# Altium schematic sheet power.SchDoc
size 209 x 297 mm; SheetNumber: 1
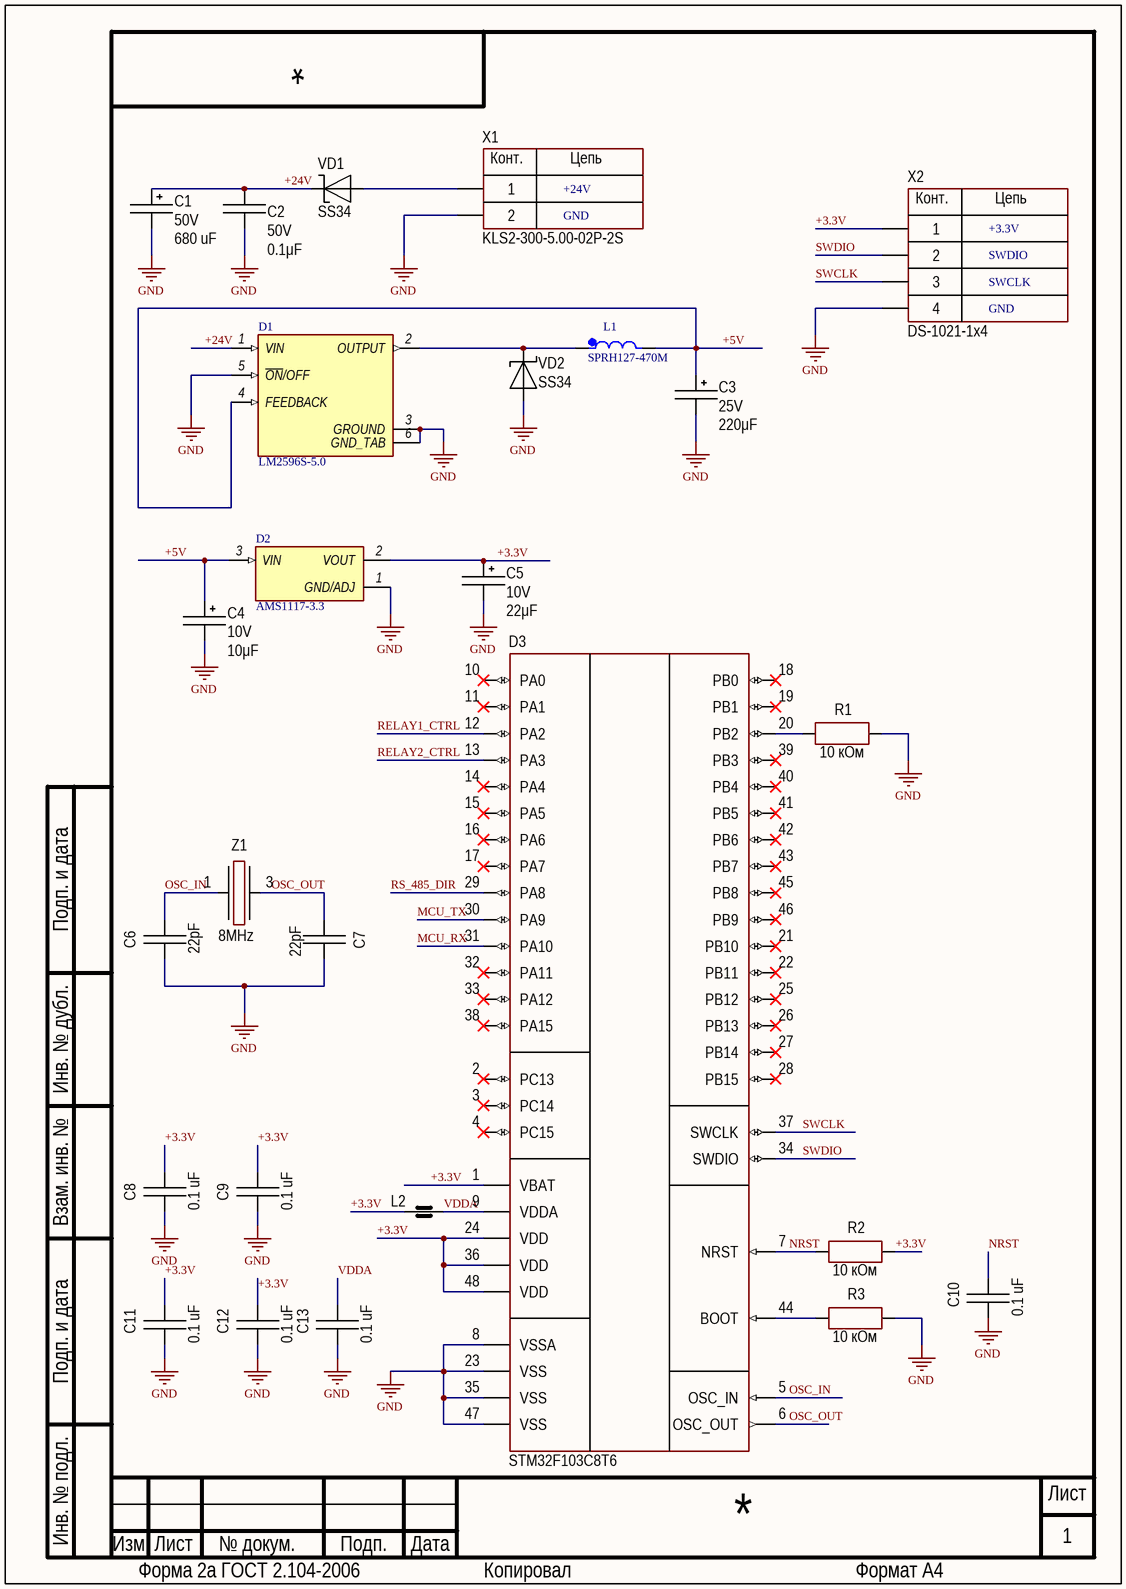
[diagram p0: power.SchDoc]

## Parts
C1  value 680 uF  Voltage: 50V  [CAP: D13C5H20]  (hidden comment: JRB1H681M05001300200000B)
C2  value 0.1μF  Voltage: 50V  [CAP: 0603]
C3  value 220μF  Voltage: 25V  [CAP: D8C3.5H12]  (hidden comment: JRB1E221M03500800120000B)
C4  value 10μF  Voltage: 10V  [CAP: TANTAL-A]
C5  value 22μF  Voltage: 10V  [CAP: TANTAL-B]
C6  22pF  [CH0603C]
C7  22pF  [CH0603C]
C8  0.1 uF  [CH0603C]
C9  0.1 uF  [CH0603C]
C10  0.1 uF  [CH0603C]
C11  0.1 uF  [CH0603C]
C12  0.1 uF  [CH0603C]
C13  0.1 uF  [CH0603C]
D1  LM2596S-5.0  [TO170P1524X483-6N]
D2  AMS1117-3.3  [SOT229P700X180-4N]
D3  STM32F103C8T6  [48-LQFP]
L1  SPRH127-470M  [IND_SPRH127-470M]
L2  *  [CH0603R]  (value not drawn)
R1  10 кОм  [CH0603R]
R2  10 кОм  [CH0603R]
R3  10 кОм  [CH0603R]
VD1  SS34  [SMC]
VD2  SS34  [SMC]
X1  KLS2-300-5.00-02P-2S  [CON: 300-02P-5.0]
X2  DS-1021-1x4  [CON: PLS-4]
Z1  8MHz  [OSC: 2520]

## Nets
GND: C1.2 C2.1 C3.2 C4.2 C5.2 C6.1 C7.2 C8.1 C9.1 C10.1 C11.1 C12.1 C13.1 D1.3(GROUND) D1.5(~{ON}/OFF) D1.6(GND_TAB) D2.1(GND/ADJ) D3.8(VSSA) D3.23(VSS) D3.35(VSS) D3.47(VSS) R1.2 R3.2 VD2.1 X1.2 X2.4
+3.3V: C5.1 C8.2 C9.2 C11.2 C12.2 D2.2(VOUT) D3.1(VBAT) D3.24(VDD) D3.36(VDD) D3.48(VDD) L2.1 R2.2 X2.1
+5V: C3.1 C4.1 D1.4(FEEDBACK) D2.3(VIN) L1.2
+24V: C1.1 C2.2 D1.1(VIN) VD1.2
MCU_RX: D3.31(PA10)
MCU_TX: D3.30(PA9)
NRST: C10.2 D3.7(NRST) R2.1
OSC_IN: C6.2 D3.5(OSC_IN) Z1.1
OSC_OUT: C7.1 D3.6(OSC_OUT) Z1.3
RELAY1_CTRL: D3.12(PA2)
RELAY2_CTRL: D3.13(PA3)
RS_485_DIR: D3.29(PA8)
SWCLK: D3.37(SWCLK) X2.3
SWDIO: D3.34(SWDIO) X2.2
VDDA: C13.2 D3.9(VDDA) L2.2
NetD1_2: D1.2(OUTPUT) L1.1 VD2.2
NetD3_20: D3.20(PB2) R1.1
NetD3_44: D3.44(BOOT) R3.1
NetVD1_1: VD1.1 X1.1

Not connected (* = marked no-connect by the designer): D3 2(PC13)* 3(PC14)* 4(PC15)* 10(PA0)* 11(PA1)* 14(PA4)* 15(PA5)* 16(PA6)* 17(PA7)* 18(PB0)* 19(PB1)* 21(PB10)* 22(PB11)* 25(PB12)* 26(PB13)* 27(PB14)* 28(PB15)* 32(PA11)* 33(PA12)* 38(PA15)* 39(PB3)* 40(PB4)* 41(PB5)* 42(PB6)* 43(PB7)* 45(PB8)* 46(PB9)*

## Notes on the sheet
- +24V
- GND
- +3.3V
- SWDIO
- SWCLK
- Подп. и дата
- Инв. № дубл.
- Взам. инв. №
- Инв. № подл.
- Изм.
- Лист
- № докум.
- Подп.
- Дата
- Форма 2а ГОСТ 2.104-2006
- Копировал
- Формат А4
- (in symbol 2-Connector) Конт.; Цепь
- (in symbol 4-Connector) Конт.; Цепь

## Library data of the parts
C1 = Aluminium: Manufacturer: Wurth; PartNumber: 860080475013; ValueManufacturerPartNumber: Aluminium capacitor, 680 uF, 50V, ±20%, 54mOhm, 14x10x5 mm, -55...+105°C; TypeCapacitor: Aluminium capacitor; Tolerance: ±20%; Impedance: 54mOhm; Package: 14x10x5 mm; HelpURL: https://www.digikey.com/product-detail/en/wurth-electronics-inc/860080475013/732-9029-1-ND/5728972; Temperature: -55...+105°C
C2 = Ceramic_0603: Manufacturer: Yageo; PartNumber: CC0603KRX7R7BB104; ValueManufacturerPartNumber: Ceramic capacitor, 0.1μF, X7R, ±10%, 50V, 0603, -55...+125°C; TypeCapacitor: Ceramic capacitor; Tolerance: ±10%; TypeDielectric: X7R; Package: 0603; HelpURL: https://www.digikey.com/product-detail/en/yageo/CC0603KRX7R7BB104/311-1088-1-ND/302998; Temperature: -55...+125°C
C3 = Aluminium: Manufacturer: Wurth; PartNumber: 860080475013; ValueManufacturerPartNumber: Aluminium capacitor, 220μF, 25V, ±20%, 54mOhm, 14x10x5 mm, -55...+105°C; TypeCapacitor: Aluminium capacitor; Tolerance: ±20%; Impedance: 54mOhm; Package: 14x10x5 mm; HelpURL: https://www.digikey.com/product-detail/en/wurth-electronics-inc/860080475013/732-9029-1-ND/5728972; Temperature: -55...+105°C
C4 = Tantal_A: Manufacturer: AVX; PartNumber: F930J107KAAAJ6; ValueManufacturerPartNumber: Tantalum capacitor, 10μF, 10V, ±10%, 2Ohm, case A (3216), -55...+125°C; Impedance: 2Ohm; Tolerance: ±10%; TypeDielectric: X7R; TypeCapacitor: Tantalum capacitor; Package: case A (3216); HelpURL: https://www.digikey.com/product-detail/en/avx-corporation/F930J107KAAAJ6/478-12404-1-ND/9645231; Temperature: -55...+125°C
C5 = Tantal_B: Manufacturer: AVX; PartNumber: F930J227KBA; ValueManufacturerPartNumber: Tantalum capacitor, 22μF, 10V, ±10%, 1.2Ohm, case B (3528), -55...+125°C; Impedance: 1.2Ohm; Tolerance: ±10%; TypeDielectric: X7R; TypeCapacitor: Tantalum capacitor; Package: case B (3528); HelpURL: https://www.digikey.com/product-detail/en/avx-corporation/F930J227KBA/478-8166-1-ND/4005570; Temperature: -55...+125°C
C6-C13 = Capacitor: Manufacturer: *; Model: *; HelpURL: *; ComponentKind: *; Value: *
D1 = LM2596S-5.0: SIMPLE SWITCHERÂ® 4.5V to 40V, 3A Low Component Count Step-Down Regulator; MF: Texas Instruments; MP: LM2596S-5.0/NOPB; SnapEDA_Link: https://www.snapeda.com/parts/LM2596S-5.0/NOPB/Texas+Instruments/view-part/?ref=snap; Package: TO-263-5 Texas Instruments; Value: *; Check_prices: https://www.snapeda.com/parts/LM2596S-5.0/NOPB/Texas+Instruments/view-part/?ref=eda
D2 = AMS1117-3.3: Sot223/Pkg 1-Amp 3.3-Volt Low Drop Out Voltage Regulatator; MF: Advanced Monolithic Systems; SnapEDA_Link: https://www.snapeda.com/parts/AMS1117-3.3/Advanced+Monolithic+Systems/view-part/?ref=snap; Package: SOT-223 Seeed Technology; Value: *; MP: AMS1117-3.3; Check_prices: https://www.snapeda.com/parts/AMS1117-3.3/Advanced+Monolithic+Systems/view-part/?ref=eda
D3 = STM32F103C8T6: Cortex-M3; Manufacturer: ST Microelectronics; Model: STM32F103C8T6; ComponentKind: 48-LQFP; HelpURL: https://www.digikey.com/product-detail/en/stmicroelectronics/STM32F103C8T6/497-6063-ND/1646338
L1 = SPRH127-470M: MF: {'manufacturer': u'CODACA'}; Package: None; Price: None; Value: *; MP: SPRH127-470M; Availability: Unavailable
L2 = Bead: Manufacturer: *; Model: *; HelpURL: *; ComponentKind: *; Value: *
R1-R3 = Resistor: Manufacturer: *; Model: *; HelpURL: *; ComponentKind: *; Value: *
VD1 VD2 = Diod Schottky: ComponentKind: *; Manufacturer: *; Model: *; HelpURL: *
X1 = 2-Connector: Model: *; Manufacturer: *; HelpURL: *; ComponentKind: *
X2 = 4-Connector: Model: *; Manufacturer: *; HelpURL: *; ComponentKind: *
Z1 = Oscillator: Manufacturer: *; Model: *; HelpURL: *; ComponentKind: *; Value: *